# EAGLE design videopac_cart_V1.2_display (EAGLE 7.5.0)
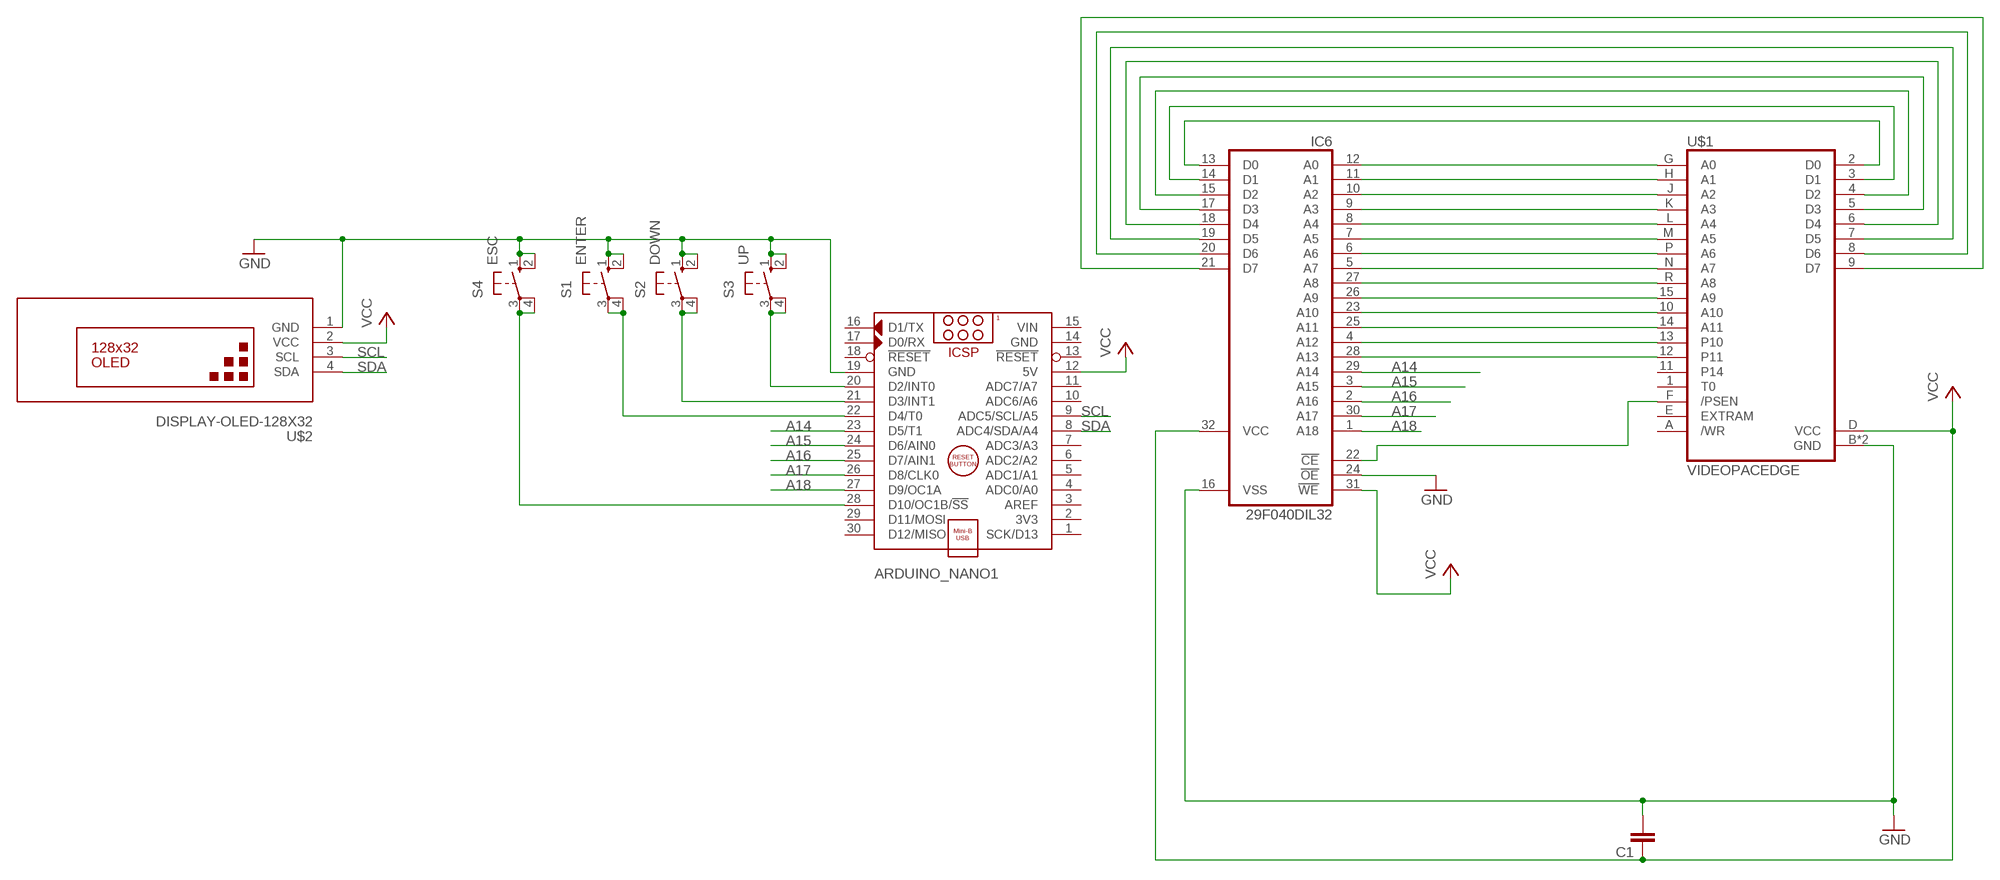
[diagram p0: schematic, sheet 1]

## Parts
ARDUINO_NANO1  ARDUINO_NANO  [ARDUINO_NANO]
C1  C-EU025-030X050  [C025-030X050]
IC6  29F040DIL32  [DIL32]
S1  ENTER  10-XX  [B3F-10XX]
S2  DOWN  10-XX  [B3F-10XX]
S3  UP  10-XX  [B3F-10XX]
S4  ESC  10-XX  [B3F-10XX]
U$1  VIDEOPACEDGE  [VIDEOPAC]
U$2  DISPLAY-OLED-128X32  [DISPLAY-OLED-128X32]

## Nets
A14: ARDUINO_NANO1.23(D5/T1) IC6.29(A14)
A15: ARDUINO_NANO1.24(D6/AIN0) IC6.3(A15)
A16: ARDUINO_NANO1.25(D7/AIN1) IC6.2(A16)
A17: ARDUINO_NANO1.26(D8/CLK0) IC6.30(A17)
A18: ARDUINO_NANO1.27(D9/OC1A) IC6.1(A18)
GND [power]: ARDUINO_NANO1.19(GND) C1.2 IC6.16(VSS) IC6.24(!OE) S1.1(S) S1.2(S1) S2.1(S) S2.2(S1) S3.1(S) S3.2(S1) S4.1(S) S4.2(S1) U$1.B(GND) U$1.C(GND) U$2.1(GND)
N$1: IC6.12(A0) U$1.G(A0)
N$2: IC6.11(A1) U$1.H(A1)
N$3: IC6.10(A2) U$1.J(A2)
N$4: IC6.9(A3) U$1.K(A3)
N$5: IC6.8(A4) U$1.L(A4)
N$6: IC6.7(A5) U$1.M(A5)
N$7: IC6.6(A6) U$1.P(A6)
N$8: IC6.5(A7) U$1.N(A7)
N$9: IC6.27(A8) U$1.R(A8)
N$10: IC6.26(A9) U$1.15(A9)
N$11: IC6.23(A10) U$1.10(A10)
N$12: IC6.25(A11) U$1.14(A11)
N$13: IC6.4(A12) U$1.13(P10)
N$14: IC6.28(A13) U$1.12(P11)
N$15: ARDUINO_NANO1.28(D10/OC1B/!SS) S4.3(P) S4.4(P1)
N$18: ARDUINO_NANO1.20(D2/INT0) S3.3(P) S3.4(P1)
N$19: ARDUINO_NANO1.21(D3/INT1) S2.3(P) S2.4(P1)
N$20: IC6.22(!CE) U$1.F(/PSEN)
N$21: IC6.13(D0) U$1.2(D0)
N$22: IC6.14(D1) U$1.3(D1)
N$23: IC6.15(D2) U$1.4(D2)
N$24: IC6.17(D3) U$1.5(D3)
N$25: IC6.18(D4) U$1.6(D4)
N$26: IC6.19(D5) U$1.7(D5)
N$27: IC6.20(D6) U$1.8(D6)
N$28: IC6.21(D7) U$1.9(D7)
N$31: ARDUINO_NANO1.22(D4/T0) S1.3(P) S1.4(P1)
SCL: ARDUINO_NANO1.9(ADC5/SCL/A5) U$2.3(SCL)
SDA: ARDUINO_NANO1.8(ADC4/SDA/A4) U$2.4(SDA)
VCC [power]: ARDUINO_NANO1.12(5V) C1.1 IC6.31(!WE) IC6.32(VCC) U$1.D(VCC) U$2.2(VCC)
Unconnected: ARDUINO_NANO1.1(SCK/D13) ARDUINO_NANO1.2(3V3) ARDUINO_NANO1.3(AREF) ARDUINO_NANO1.4(ADC0/A0) ARDUINO_NANO1.5(ADC1/A1) ARDUINO_NANO1.6(ADC2/A2) ARDUINO_NANO1.7(ADC3/A3) ARDUINO_NANO1.10(ADC6/A6) ARDUINO_NANO1.11(ADC7/A7) ARDUINO_NANO1.13(!RESET) ARDUINO_NANO1.16(D1/TX) ARDUINO_NANO1.17(D0/RX) ARDUINO_NANO1.18(!RESET) ARDUINO_NANO1.29(D11/MOSI) ARDUINO_NANO1.30(D12/MISO) U$1.1(T0) U$1.11(P14) U$1.A(/WR) U$1.E(EXTRAM)

## Power pins joined to a net without a drawn wire
GND: ARDUINO_NANO1.14(GND)
VIN: ARDUINO_NANO1.15(VIN)

## Library data of the parts
ARDUINO_NANO1 = ArduinoNanoV30:ARDUINO_NANO: Arduino Nano V3.0 Module Overview: The Arduino Nano is a small, complete, and breadboard-friendly board based on the ATmega328 (Arduino Nano 3.x) or ATmega168 (Arduino Nano 2.x). It has more or less the same functionality of the Arduino Duemilanove, but in a different package. It lacks only a DC power jack, and works with a Mini-B USB cable instead of a standard one. The Nano was designed and is being produced by Gravitech <http://www.gravitech.us/arna30wiatp.html>. General specifications: Item Value Microcontroller Atmel ATmega168 or ATmega328 Operating Voltage (logic level) 5 V Input Voltage (recommended) 7-12 V Input Voltage (limits) 6-20 V Digital I/O Pins 14 (of which 6 provide PWM output) Analog Input Pins 8 DC Current per I/O Pin 40 mA Flash Memory 16 KB (ATmega168) or 32 KB (ATmega328) of which 2 KB used by bootloader SRAM 1 KB (ATmega168) or 2 KB (ATmega328) EEPROM 512 bytes (ATmega168) or 1 KB (ATmega328) Clock Speed 16 MHz Dimensions (Inches) 0.73" x 1.70" Dimensions (mm) 18mm x 45mm Overall height About 9 mm (not including pins) Weigth 5 g Power: The Arduino Nano can be powered via the Mini-B USB connection, 6-20V unregulated external power supply (pin 30), or 5V regulated external power supply (pin 27). The power source is automatically selected to the highest voltage source. Memory: The ATmega168 has 16 KB of flash memory for storing code (of which 2 KB is used for the bootloader); the ATmega328 has 32 KB, (also with 2 KB used for the bootloader). The ATmega168 has 1 KB of SRAM and 512 bytes of EEPROM (which can be read and written with the EEPROM library); the ATmega328 has 2 KB of SRAM and 1 KB of EEPROM. Input and Output: Each of the 14 digital pins on the Nano can be used as an input or output, using pinMode(), digitalWrite(), and digitalRead() functions. They operate at 5 volts. Each pin can provide or receive a maximum of 40 mA and has an internal pull-up resistor (disconnected by default) of 20-50 kOhms. In addition, some pins have specialized functions. Visit Arduino - ArduinoBoardNano <https://www.arduino.cc/en/Main/ArduinoBoardNano>
C1 = rcl:C-EU: CAPACITOR, European symbol
IC6 = Mio:29F040
S1-S4 = switch-omron:10-XX: OMRON SWITCH; MPN: B3F-1000; OC_FARNELL: 176432; OC_NEWARK: 36M3542
U$1 = BUSES:VIDEOPAC
U$2 = diy-modules:DISPLAY-OLED-128X32: 128x32 Dot Matrix OLED Module with I2C interface based on SSD1306 chip More details available here: http://www.tinyosshop.com/index.php?route=product/product&product_id=953 Schematic available here: http://www.tinyosshop.com/datasheet/OLED%2012832.pdf SSD1306 datasheet: https://cdn-shop.adafruit.com/datasheets/SSD1306.pdf Click here to find device on ebay.com <http://www.ebay.com/sch/oled+display+128x32+i2c>

## Net classes
0 default: width 0.406 mm
1 power: width 0.61 mm

## Board
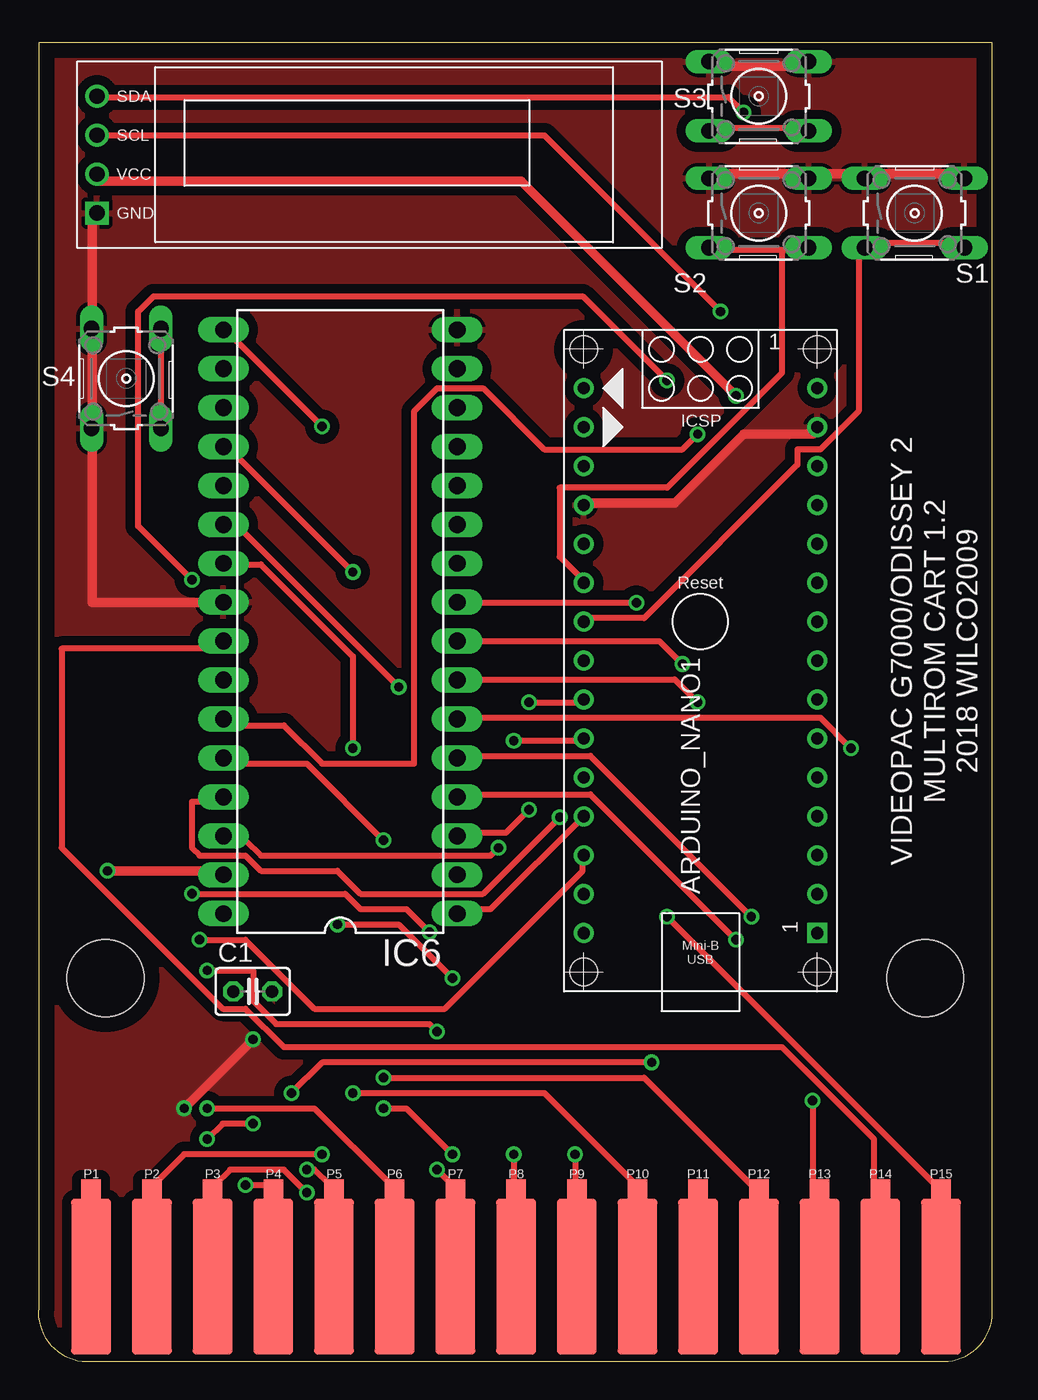
[diagram p1: board, top side]
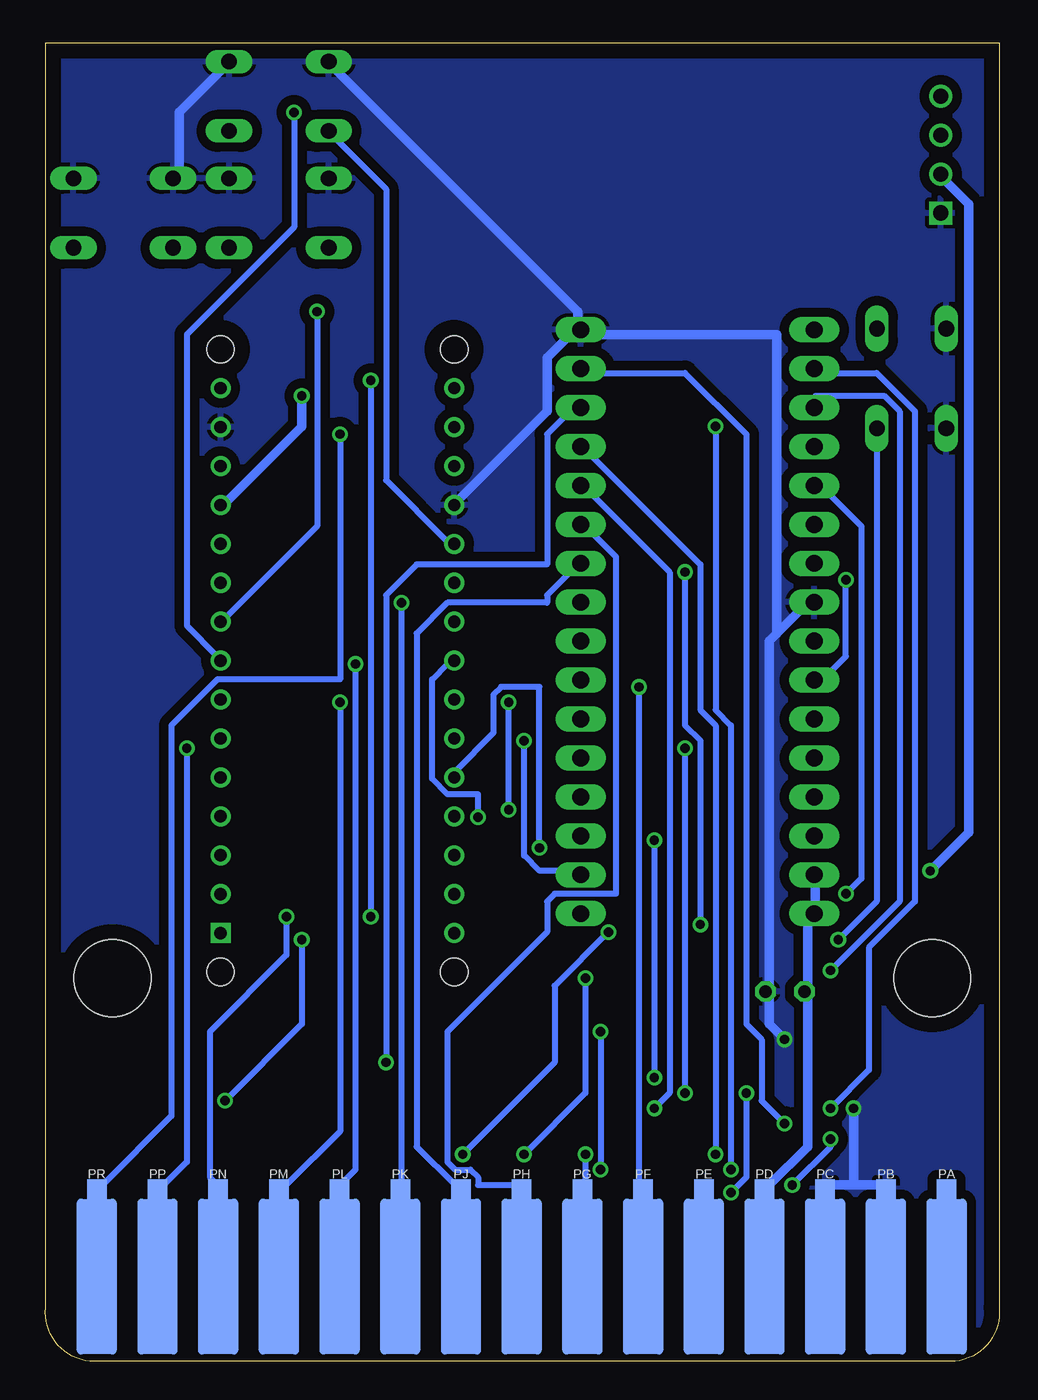
[diagram p2: board, bottom side, seen from below]

Size 62.24 x 86.03 mm. Coordinates in mm from the lower left corner, seen from the top.
Outline: 0.02,86.03 0.02,3.5 arc90 2.88,0 59.36,0 arc90 62.23,3.5 62.23,86.03 0.02,86.03
Copper layers (1*16): Top 0.035mm / dielectric 1.5mm / Bottom 0.035mm
Design rules "default *": minimum track width 16mil, minimum drill 24mil, track to track 8mil, track to pad 8mil, pad to pad 8mil, via to via 8mil, smd to smd 8mil, copper to edge 40mil, drill to drill 8mil, minimum pad ring 10mil, minimum via ring 8mil, stop-mask expansion 4mil, vias tented up to drill 0mil, thermal gap 10mil
Holes 5 mm at 4.38,25 57.86,25

### Footprints (pad centres in the part's own frame; a part is rotated, then mirrored left to right if it is on the bottom)
ARDUINO_NANO = drill 0.8 square: 1 -20.32,-7.62 | drill 0.8: 2 -17.78,-7.62; 3 -15.24,-7.62; 4 -12.7,-7.62; 5 -10.16,-7.62; 6 -7.62,-7.62; 7 -5.08,-7.62; 8 -2.54,-7.62; 9 0,-7.62; 10 2.54,-7.62; 11 5.08,-7.62; 12 7.62,-7.62; 13 10.16,-7.62; 14 12.7,-7.62; 15 15.24,-7.62; 16 15.24,7.62; 17 12.7,7.62; 18 10.16,7.62; 19 7.62,7.62; 20 5.08,7.62; 21 2.54,7.62; 22 0,7.62; 23 -2.54,7.62; 24 -5.08,7.62; 25 -7.62,7.62; 26 -10.16,7.62; 27 -12.7,7.62; 28 -15.24,7.62; 29 -17.78,7.62; 30 -20.32,7.62 | hole 1.778: -22.86,-7.62; -22.86,7.62; 17.78,7.62; 17.78,-7.62
C025-030X050 = drill 0.813 octagon: 1 -1.27,0; 2 1.27,0
DIL32 = drill 1.1 long: 1 -21.59,-8.89; 2 -19.05,-8.89; 3 -16.51,-8.89; 4 -13.97,-8.89; 5 -11.43,-8.89; 6 -8.89,-8.89; 7 -6.35,-8.89; 8 -3.81,-8.89; 9 -1.27,-8.89; 10 1.27,-8.89; 11 3.81,-8.89; 12 6.35,-8.89; 13 8.89,-8.89; 14 11.43,-8.89; 15 13.97,-8.89; 16 16.51,-8.89; 17 16.51,6.35; 18 13.97,6.35; 19 11.43,6.35; 20 8.89,6.35; 21 6.35,6.35; 22 3.81,6.35; 23 1.27,6.35; 24 -1.27,6.35; 25 -3.81,6.35; 26 -6.35,6.35; 27 -8.89,6.35; 28 -11.43,6.35; 29 -13.97,6.35; 30 -16.51,6.35; 31 -19.05,6.35; 32 -21.59,6.35
B3F-10XX = drill 1.016 long: 1 -3.251,2.261; 2 3.251,2.261; 3 -3.251,-2.261; 4 3.251,-2.261
VIDEOPAC = smd 1.27 x 1.27: 1 -27.683,6.167; 2 -23.723,6.167; 3 -19.763,6.167; 4 -15.803,6.167; 5 -11.843,6.167; 6 -7.883,6.167; 7 -3.923,6.167; 8 0.037,6.167; 9 3.997,6.167; 10 7.957,6.167; 11 11.917,6.167; 12 15.877,6.167; 13 19.837,6.167; 14 23.797,6.167; 15 27.757,6.167 | smd 1.27 x 1.27 bottom: A -27.683,6.167; B -23.723,6.167; C -19.763,6.167; D -15.803,6.167; E -11.843,6.167; F -7.883,6.167; G -3.923,6.167; H 0.037,6.167; J 3.997,6.167; K 7.957,6.167; L 11.917,6.167; M 15.877,6.167; N 19.837,6.167; P 23.797,6.167; R 27.757,6.167 | smd 2.6 x 10.16: P$1 -27.683,0.452; P$2 -23.723,0.452; P$3 -19.763,0.452; P$4 -15.803,0.452; P$5 -11.843,0.452; P$6 -7.883,0.452; P$7 -3.923,0.452; P$8 0.037,0.452; P$9 3.997,0.452; P$10 7.957,0.452; P$11 11.917,0.452; P$12 15.877,0.452; P$13 19.837,0.452; P$14 23.797,0.452; P$15 27.757,0.452 | smd 2.6 x 10.16 bottom: P$A -27.683,0.452; P$B -23.723,0.452; P$C -19.763,0.452; P$D -15.803,0.452; P$E -11.843,0.452; P$F -7.883,0.452; P$H -3.923,0.452; P$J 0.037,0.452; P$K 3.997,0.452; P$L 7.957,0.452; P$M 11.917,0.452; P$N 15.877,0.452; P$P 19.837,0.452; P$R 23.797,0.452; P$S 27.757,0.452
DISPLAY-OLED-128X32 = drill 1 square: 1 -17.78,-3.81 | drill 1: 2 -17.78,-1.27; 3 -17.78,1.27; 4 -17.78,3.81

### Placement (x,y rotation side)
ARDUINO_NANO1  43.2,48.26 90 top
C1  13.99,24.13 0 top
IC6  18.43,50.8 90 top
S1  57.17,74.93 0 top
S2  47.01,74.93 0 top
S3  47.01,82.55 0 top
S4  5.73,64.14 90 top
U$1  31.13,5.08 0 top
U$2  21.61,78.74 0 top

### Tracks (layer width: path | path; a pad name or v marks a point on that pad's centre or on a via)
A14  (via drill 0.61)
  Top 0.406: v34.02,35.5 29.02,30.5 21.02,30.5 19.52,32 14.52,32 13.52,33 10.52,33 10.02,33.5 10.02,36.5 12.02,36.5 IC6.29
  Bottom 0.406: v34.02,35.5 34.02,37 36.02,37 37.02,38 37.02,44.5 36.02,45.5 ARDUINO_NANO1.23
A15  (via drill 0.61)
  Top 0.406: v32.02,43 35.52,43 ARDUINO_NANO1.24 | v32.02,36 30.52,34.5 27.52,34.5 IC6.3
  Bottom 0.406: v32.02,36 v32.02,43
A16  (via drill 0.61)
  Top 0.406: v31.02,40.5 35.52,40.5 ARDUINO_NANO1.25
  Bottom 0.406: v31.02,40.5 31.02,33 30.02,32 27.52,32 IC6.2
A17  (via drill 0.61)
  Top 0.406: v30.02,33.5 29.52,33 14.52,33 13.52,34 12.52,34 IC6.30
  Bottom 0.406: v30.02,33.5 30.02,44 32.52,44 33.02,43.5 33.02,41 35.52,38.5 ARDUINO_NANO1.26
A18
  Top 0.406: ARDUINO_NANO1.27 29.52,29.5 27.52,29.5 IC6.1
GND  (via drill 0.61)
  Top 0.61: S3.1 44.02,84.5 50.02,84.5 S3.2 | S2.1 44.02,77.5 50.02,77.5 S2.2 50.52,77.5 53.52,77.5 S1.1 54.02,77.5 60.02,77.5 S1.2 | ARDUINO_NANO1.14 50.52,60.5 46.02,60.5 41.52,56 36.02,56 ARDUINO_NANO1.19 | U$2.1 3.52,74.5 3.52,67.5 S4.2 3.52,67 3.52,61 S4.1 3.52,60.5 3.52,49.5 12.02,49.5 IC6.24 | v14.02,21 v9.52,16.5
  Bottom 0.61: S3.2 50.52,84.5 53.52,81.5 53.52,77.5 S1.1 | 27.52,67.5 29.52,65.5 29.52,62 35.52,56 ARDUINO_NANO1.19 | 27.52,67.5 27.52,68.5 43.52,84.5 S3.1 | 27.52,67.5 IC6.16 27.02,67 14.52,67 14.52,47.5 | 9.52,11.5 11.02,11.5 U$1.C | 9.52,11.5 7.52,11.5 U$1.B | v9.52,16.5 9.52,11.5 | v14.02,21 15.02,22 15.02,24 C1.2 15.02,24.5 15.02,47 14.52,47.5 | 14.52,47.5 12.52,49.5 IC6.24
  pour Top (isolate 0.61): 0.02,86.36 62.25,86.36 62.25,0 0.02,0
  pour Bottom (isolate 0.61): 0.02,86.36 62.25,86.36 62.25,0 0.02,0
N$1  (via drill 0.61)
  Top 0.406: v27.02,13.5 24.02,16.5 v22.52,16.5
  Bottom 0.406: v27.02,13.5 27.02,11.5 U$1.G | v22.52,16.5 21.52,17.5 21.52,51.5 27.02,57 IC6.12
N$2
  Bottom 0.406: U$1.H 31.52,11.5 34.02,11.5 34.02,12 34.52,12.5 35.52,12.5 36.02,13 36.02,21.5 29.52,28 29.52,30 29.02,30.5 25.02,30.5 25.02,52.5 27.02,54.5 IC6.11
N$3
  Bottom 0.406: U$1.J 35.52,11.5 38.02,14 38.02,47.5 36.02,49.5 29.52,49.5 29.52,50 27.52,52 IC6.10
N$4  (via drill 0.61)
  Top 0.406: v39.02,49.5 27.52,49.5 IC6.9
  Bottom 0.406: v39.02,49.5 39.02,11.5 U$1.K
N$5  (via drill 0.61)
  Top 0.406: v42.02,45.5 40.52,47 27.52,47 IC6.8
  Bottom 0.406: v42.02,45.5 42.02,12.5 43.02,11.5 U$1.L
N$6  (via drill 0.61)
  Top 0.406: v43.02,43 41.52,44.5 27.52,44.5 IC6.7
  Bottom 0.406: v43.02,43 43.02,15 46.52,11.5 U$1.M
N$7  (via drill 0.61)
  Top 0.406: v53.02,40 51.02,42 27.52,42 IC6.6
  Bottom 0.406: v53.02,40 53.02,13 54.52,11.5 U$1.P
N$8  (via drill 0.61)
  Top 0.406: v46.52,29 36.02,39.5 27.52,39.5 IC6.5
  Bottom 0.406: v46.52,29 46.52,26.5 51.52,21.5 51.52,12 51.02,11.5 U$1.N
N$9  (via drill 0.61)
  Top 0.406: v43.02,60.5 42.02,59.5 33.02,59.5 29.02,63.5 26.02,63.5 24.52,62 24.52,39 18.52,39 16.02,41.5 12.52,41.5 IC6.27
  Bottom 0.406: v43.02,60.5 43.02,44.5 51.02,44.5 54.02,41.5 54.02,16 58.52,11.5 U$1.R
N$10  (via drill 0.61)
  Top 0.406: v41.02,29 58.52,11.5 U$1.15 | v41.02,64 35.52,69.5 7.52,69.5 6.52,68.5 6.52,54.5 v10.02,51
  Bottom 0.406: v41.02,64 v41.02,29 | v10.02,51 10.02,46 12.02,44 IC6.26
N$11  (via drill 0.61)
  Top 0.406: v20.52,17.5 33.02,17.5 39.02,11.5 U$1.10 | v20.52,40 20.52,46 14.52,52 12.52,52 IC6.23
  Bottom 0.406: v20.52,40 v20.52,17.5
N$12
  Top 0.406: U$1.14 54.52,11.5 54.52,14.5 48.52,20.5 16.02,20.5 13.52,23 12.02,23 1.52,33.5 1.52,46.5 12.02,46.5 IC6.25
N$13  (via drill 0.61)
  Top 0.406: v50.52,17 50.52,11.5 U$1.13 | v45.52,27.5 36.02,37 27.52,37 IC6.4
  Bottom 0.406: v50.52,17 45.52,22 v45.52,27.5
N$14  (via drill 0.61)
  Top 0.406: v22.52,18.5 39.52,18.5 46.52,11.5 U$1.12 | v22.52,34 17.52,39 12.52,39 IC6.28
  Bottom 0.406: v22.52,34 v22.52,18.5
N$15  (via drill 0.61)
  Top 0.406: v10.52,27.5 13.52,27.5 18.02,23 26.52,23 35.52,32 35.52,33 ARDUINO_NANO1.28 | S4.4 8.02,67 8.02,61 S4.3
  Bottom 0.406: v10.52,27.5 8.02,30 8.02,60.5 S4.3
N$18
  Top 0.406: S3.4 50.02,80.5 44.02,80.5 S3.3
  Bottom 0.406: ARDUINO_NANO1.20 36.02,53.5 40.02,57.5 40.02,76.5 43.52,80 S3.3
N$19
  Top 0.406: 48.52,72.5 48.52,64.5 41.02,57 34.02,57 34.02,52.5 35.52,51 ARDUINO_NANO1.21 | 48.52,72.5 50.02,72.5 S2.4 | 48.52,72.5 44.02,72.5 S2.3
N$20  (via drill 0.61)
  Top 0.406: v23.52,44 13.02,54.5 12.52,54.5 IC6.22
  Bottom 0.406: v23.52,44 23.52,11.5 U$1.F
N$21  (via drill 0.61)
  Top 0.406: v18.52,13.5 9.52,13.5 7.52,11.5 U$1.2
  Bottom 0.406: v18.52,13.5 18.52,41.5 19.52,42.5 19.52,52 27.02,59.5 IC6.13
N$22  (via drill 0.61)
  Top 0.406: v17.52,11 16.02,12.5 12.52,12.5 11.52,11.5 U$1.3 | v16.52,17.5 18.52,19.5 v40.02,19.5
  Bottom 0.406: v17.52,11 16.52,12 v16.52,17.5 | v40.02,19.5 40.02,50 38.02,52 29.52,52 29.52,60.5 27.52,62.5 IC6.14
N$23  (via drill 0.61)
  Top 0.406: v13.52,11.5 15.02,11.5 U$1.4 | v11.02,14.5 12.02,15.5 v14.02,15.5
  Bottom 0.406: v13.52,11.5 11.02,14 v11.02,14.5 | v14.02,15.5 15.52,17 15.52,21 16.52,22 16.52,60.5 20.52,64.5 27.02,64.5 IC6.15
N$24  (via drill 0.61)
  Top 0.406: v17.52,12.5 18.02,12.5 19.02,11.5 U$1.5 | v18.52,61 12.52,67 IC6.17
  Bottom 0.406: v17.52,12.5 17.52,41.5 18.52,42.5 v18.52,61
N$25  (via drill 0.61)
  Top 0.406: v11.02,16.5 18.02,16.5 23.02,11.5 U$1.6
  Bottom 0.406: v11.02,16.5 8.52,19 8.52,27 5.52,30 5.52,62 8.02,64.5 12.02,64.5 IC6.18
N$26  (via drill 0.61)
  Top 0.406: v26.02,12.5 27.02,11.5 U$1.7 | v26.02,21.5 25.52,22 15.52,22 14.02,23.5 14.02,25.5 v11.02,25.5
  Bottom 0.406: v26.02,21.5 v26.02,12.5 | v11.02,25.5 6.52,30 6.52,62 7.52,63 12.02,63 12.02,62.5 IC6.19
N$27  (via drill 0.61)
  Top 0.406: v31.02,13.5 31.02,11.5 U$1.8 | v27.02,25 23.52,28.5 v19.52,28.5 | v20.52,51.5 12.52,59.5 IC6.20
  Bottom 0.406: v31.02,13.5 27.02,17.5 v27.02,25 | v19.52,28.5 19.52,40.5 20.52,41.5 v20.52,51.5
N$28  (via drill 0.61)
  Top 0.406: v35.02,13.5 35.02,11.5 U$1.9 | v25.52,28 24.02,29.5 21.02,29.5 20.02,30.5 v10.02,30.5
  Bottom 0.406: v35.02,13.5 29.02,19.5 29.02,24.5 v25.52,28 | v10.02,30.5 9.02,31.5 9.02,54.5 12.02,57.5 IC6.21
N$31
  Top 0.406: ARDUINO_NANO1.22 36.02,48.5 39.52,48.5 49.52,58.5 49.52,59.5 51.02,59.5 53.52,62 53.52,72.5 S1.3 54.02,73 60.02,73 S1.4
SCL  (via drill 0.61)
  Top 0.406: v44.52,68.5 33.02,80 4.02,80 U$2.3
  Bottom 0.406: v44.52,68.5 44.52,54.5 50.52,48.5 ARDUINO_NANO1.9
SDA  (via drill 0.61)
  Top 0.406: v46.02,81.5 45.02,82.5 4.02,82.5 U$2.4
  Bottom 0.406: v46.02,81.5 46.02,74 53.02,67 53.02,48 51.02,46 ARDUINO_NANO1.8
VCC  (via drill 0.61)
  Top 0.61: v45.52,63 31.52,77 4.02,77 U$2.2 | v4.52,32 12.02,32 IC6.31
  Bottom 0.61: IC6.31 12.02,31.5 12.02,29.5 IC6.32 12.52,29 12.52,24.5 C1.1 12.52,24 12.52,14 15.02,11.5 U$1.D | v45.52,63 45.52,61 50.52,56 ARDUINO_NANO1.12 | v4.52,32 2.02,34.5 2.02,75.5 3.52,77 U$2.2

### Text on the board
tPlace: VIDEOPAC G7000/ODISSEY 2 / MULTIROM CART 1.2 / 2018 WILCO2009